# EAGLE design mcp23s17 (EAGLE 6.4)
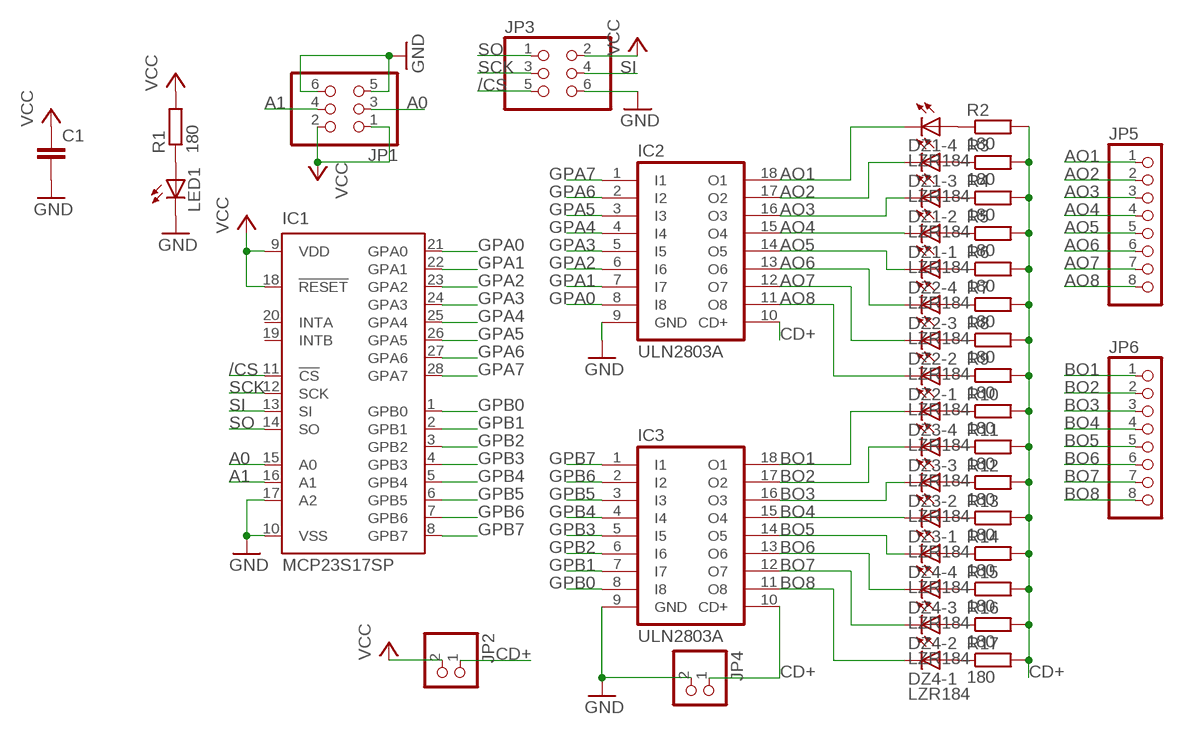
[diagram p0: schematic, sheet 1]

## Parts
C1  C-EU050-024X044  [C050-024X044]
DZ1  LZR184  [LZR184]
DZ2  LZR184  [LZR184]
DZ3  LZR184  [LZR184]
DZ4  LZR184  [LZR184]
IC1  MCP23S17SP  [DIL28-3]
IC2  ULN2803A  [DIL18]
IC3  ULN2803A  [DIL18]
JP1  PINHD-2X3  [2X03]
JP2  PINHD-1X2  [1X02]
JP3  PINHD-2X3  [2X03]
JP4  PINHD-1X2  [1X02]
JP5  PINHD-1X8  [1X08]
JP6  PINHD-1X8  [1X08]
LED1  LED3MM  [LED3MM]
R1  180  R-EU_0204/2V  [0204V]
R2  180  R-EU_0204/2V  [0204V]
R3  180  R-EU_0204/2V  [0204V]
R4  180  R-EU_0204/2V  [0204V]
R5  180  R-EU_0204/2V  [0204V]
R6  180  R-EU_0204/2V  [0204V]
R7  180  R-EU_0204/2V  [0204V]
R8  180  R-EU_0204/2V  [0204V]
R9  180  R-EU_0204/2V  [0204V]
R10  180  R-EU_0204/2V  [0204V]
R11  180  R-EU_0204/2V  [0204V]
R12  180  R-EU_0204/2V  [0204V]
R13  180  R-EU_0204/2V  [0204V]
R14  180  R-EU_0204/2V  [0204V]
R15  180  R-EU_0204/2V  [0204V]
R16  180  R-EU_0204/2V  [0204V]
R17  180  R-EU_0204/2V  [0204V]

## Nets
/CS: IC1.11(!CS) JP3.5
A0: IC1.15(A0) JP1.3
A1: IC1.16(A1) JP1.4
AO1: DZ1.K4(-4:C) IC2.18(O1) JP5.1
AO2: DZ1.K3(-3:C) IC2.17(O2) JP5.2
AO3: DZ1.K2(-2:C) IC2.16(O3) JP5.3
AO4: DZ1.K1(-1:C) IC2.15(O4) JP5.4
AO5: DZ2.K4(-4:C) IC2.14(O5) JP5.5
AO6: DZ2.K3(-3:C) IC2.13(O6) JP5.6
AO7: DZ2.K2(-2:C) IC2.12(O7) JP5.7
AO8: DZ2.K1(-1:C) IC2.11(O8) JP5.8
BO1: DZ3.K4(-4:C) IC3.18(O1) JP6.1
BO2: DZ3.K3(-3:C) IC3.17(O2) JP6.2
BO3: DZ3.K2(-2:C) IC3.16(O3) JP6.3
BO4: DZ3.K1(-1:C) IC3.15(O4) JP6.4
BO5: DZ4.K4(-4:C) IC3.14(O5) JP6.5
BO6: DZ4.K3(-3:C) IC3.13(O6) JP6.6
BO7: DZ4.K2(-2:C) IC3.12(O7) JP6.7
BO8: DZ4.K1(-1:C) IC3.11(O8) JP6.8
CD+: IC2.10(CD+) IC3.10(CD+) JP2.1 JP4.1 R2.2 R3.2 R4.2 R5.2 R6.2 R7.2 R8.2 R9.2 R10.2 R11.2 R12.2 R13.2 R14.2 R15.2 R16.2 R17.2
GND: C1.2 IC1.10(VSS) IC1.17(A2) IC2.9(GND) IC3.9(GND) JP1.5 JP1.6 JP3.6 JP4.2 LED1.K(C)
GPA0: IC1.21(GPA0) IC2.8(I8)
GPA1: IC1.22(GPA1) IC2.7(I7)
GPA2: IC1.23(GPA2) IC2.6(I6)
GPA3: IC1.24(GPA3) IC2.5(I5)
GPA4: IC1.25(GPA4) IC2.4(I4)
GPA5: IC1.26(GPA5) IC2.3(I3)
GPA6: IC1.27(GPA6) IC2.2(I2)
GPA7: IC1.28(GPA7) IC2.1(I1)
GPB0: IC1.1(GPB0) IC3.8(I8)
GPB1: IC1.2(GPB1) IC3.7(I7)
GPB2: IC1.3(GPB2) IC3.6(I6)
GPB3: IC1.4(GPB3) IC3.5(I5)
GPB4: IC1.5(GPB4) IC3.4(I4)
GPB5: IC1.6(GPB5) IC3.3(I3)
GPB6: IC1.7(GPB6) IC3.2(I2)
GPB7: IC1.8(GPB7) IC3.1(I1)
N$2: LED1.A R1.1
N$3: DZ3.A4(-4:A) R10.1
N$4: DZ3.A3(-3:A) R11.1
N$5: DZ3.A2(-2:A) R12.1
N$6: DZ3.A1(-1:A) R13.1
N$7: DZ4.A4(-4:A) R14.1
N$8: DZ4.A3(-3:A) R15.1
N$9: DZ4.A2(-2:A) R16.1
N$13: DZ4.A1(-1:A) R17.1
N$36: DZ1.A4(-4:A) R2.1
N$37: DZ1.A3(-3:A) R3.1
N$38: DZ1.A2(-2:A) R4.1
N$39: DZ1.A1(-1:A) R5.1
N$40: DZ2.A4(-4:A) R6.1
N$41: DZ2.A3(-3:A) R7.1
N$42: DZ2.A2(-2:A) R8.1
N$43: DZ2.A1(-1:A) R9.1
SCK: IC1.12(SCK) JP3.3
SI: IC1.13(SI) JP3.4
SO: IC1.14(SO) JP3.1
VCC: C1.1 IC1.9(VDD) IC1.18(!RESET) JP1.1 JP1.2 JP2.2 JP3.2 R1.2
Unconnected: IC1.19(INTB) IC1.20(INTA)

## Library data of the parts
C1 = rcl:C-EU: CAPACITOR, European symbol
DZ1-DZ4 = led:LZR184: LED BLOCK 4 LEDs, Siemens
IC1 = microchip:MCP23S17: http://ww1.microchip.com/downloads/en/DeviceDoc/21952a.pdf Source: http://ww1.microchip.com/downloads/en/DeviceDoc/21952a.pdf; MF: MICROCHIP; MPN: MCP23S17-E/SP; OC_FARNELL: 1292238; OC_NEWARK: 31K2951
IC2 IC3 = uln-udn:ULN2803A: DRIVER ARRAY
JP1 JP3 = pinhead:PINHD-2X3: PIN HEADER
JP2 JP4 = pinhead:PINHD-1X2: PIN HEADER
JP5 JP6 = pinhead:PINHD-1X8: PIN HEADER
LED1 = led:LED: LED OSRAM: - CHIPLED LG R971, LG N971, LY N971, LG Q971, LY Q971, LO R971, LY R971 LH N974, LH R974 LS Q976, LO Q976, LY Q976 LO Q996 - Hyper CHIPLED LW Q18S LB Q993, LB Q99A, LB R99A - SideLED LS A670, LO A670, LY A670, LG A670, LP A670 LB A673, LV A673, LT A673, LW A673 LH A674 LY A675 LS A676, LA A676, LO A676, LY A676, LW A676 LS A679, LY A679, LG A679 - Hyper Micro SIDELED® LS Y876, LA Y876, LO Y876, LY Y876 LT Y87S - SmartLED LW L88C, LW L88S LB L89C, LB L89S, LG L890 LS L89K, LO L89K, LY L89K LS L896, LA L896, LO L896, LY L896 - TOPLED LS T670, LO T670, LY T670, LG T670, LP T670 LSG T670, LSP T670, LSY T670, LOP T670, LYG T670 LG T671, LOG T671, LSG T671 LB T673, LV T673, LT T673, LW T673 LH T674 LS T676, LA T676, LO T676, LY T676, LB T676, LH T676, LSB T676, LW T676 LB T67C, LV T67C, LT T67C, LS T67K, LO T67K, LY T67K, LW E67C LS E67B, LA E67B, LO E67B, LY E67B, LB E67C, LV E67C, LT E67C LW T67C LS T679, LY T679, LG T679 LS T770, LO T770, LY T770, LG T770, LP T770 LB T773, LV T773, LT T773, LW T773 LH T774 LS E675, LA E675, LY E675, LS T675 LS T776, LA T776, LO T776, LY T776, LB T776 LHGB T686 LT T68C, LB T68C - Hyper Mini TOPLED® LB M676 - Mini TOPLED Santana® LG M470 LS M47K, LO M47K, LY M47K Source: http://www.osram.convergy.de LUXEON: - LUMILED® LXK2-PW12-R00, LXK2-PW12-S00, LXK2-PW14-U00, LXK2-PW14-V00 LXK2-PM12-R00, LXK2-PM12-S00, LXK2-PM14-U00 LXK2-PE12-Q00, LXK2-PE12-R00, LXK2-PE12-S00, LXK2-PE14-T00, LXK2-PE14-U00 LXK2-PB12-K00, LXK2-PB12-L00, LXK2-PB12-M00, LXK2-PB14-N00, LXK2-PB14-P00, LXK2-PB14-Q00 LXK2-PR12-L00, LXK2-PR12-M00, LXK2-PR14-Q00, LXK2-PR14-R00 LXK2-PD12-Q00, LXK2-PD12-R00, LXK2-PD12-S00 LXK2-PH12-R00, LXK2-PH12-S00 LXK2-PL12-P00, LXK2-PL12-Q00, LXK2-PL12-R00 Source: www.luxeon.com KINGBRIGHT: KA-3528ASYC Source: www.kingbright.com
R1-R17 = resistor:R-EU_: RESISTOR, European symbol

## Board
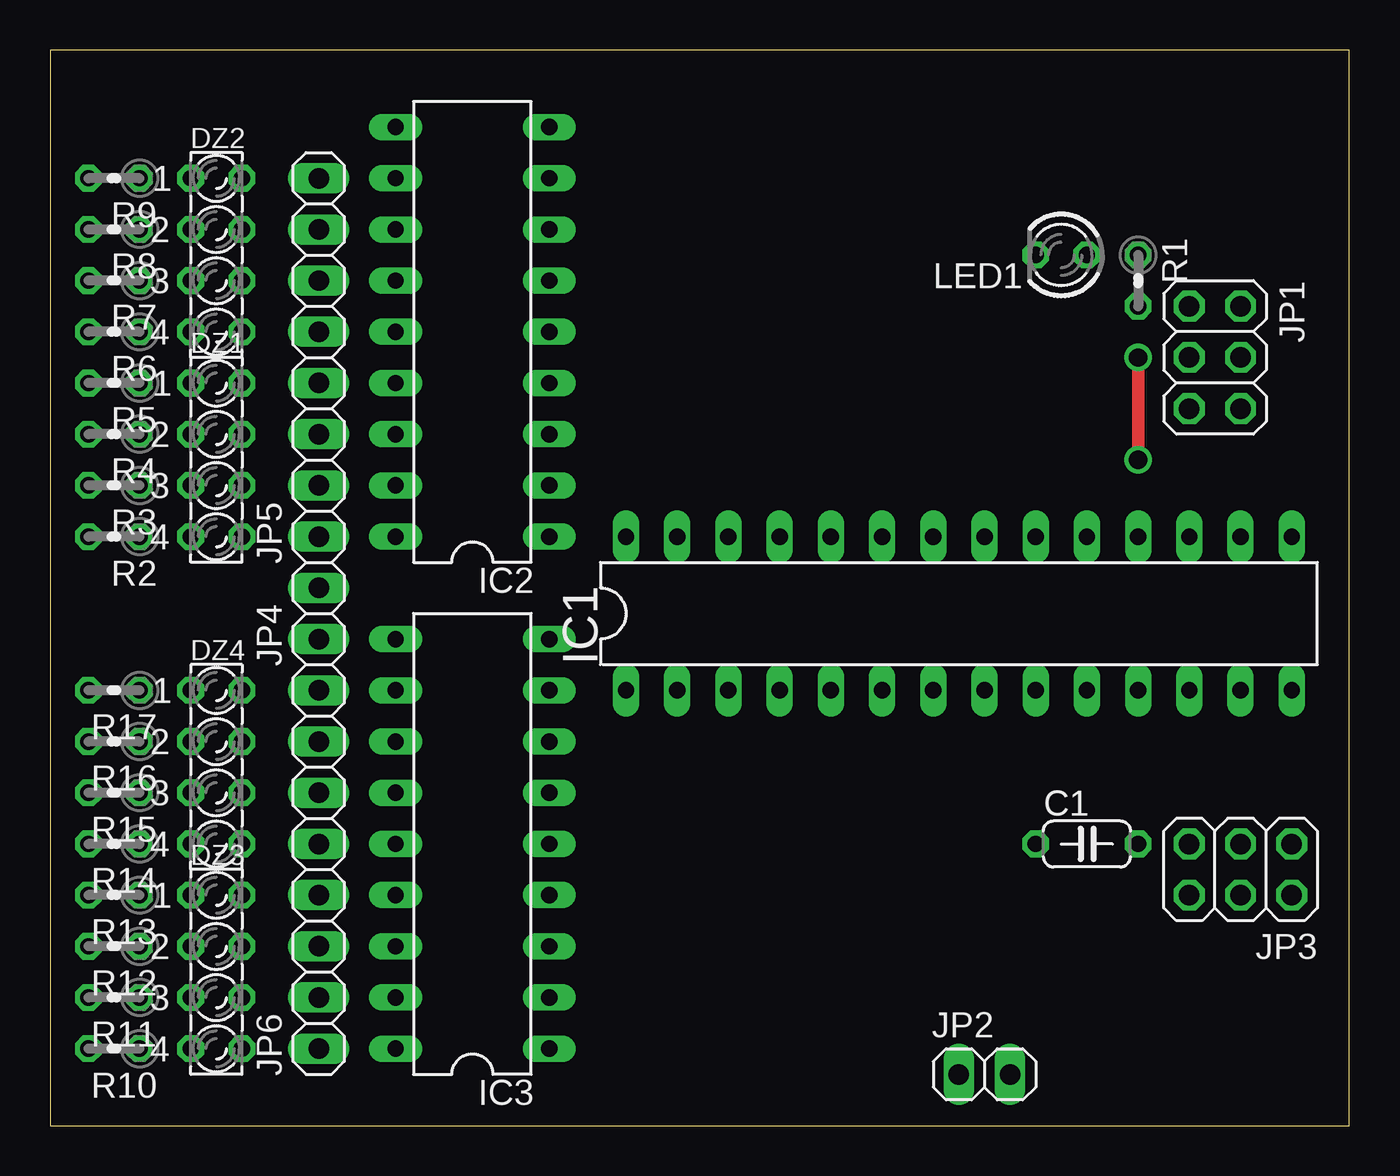
[diagram p1: board, top side]
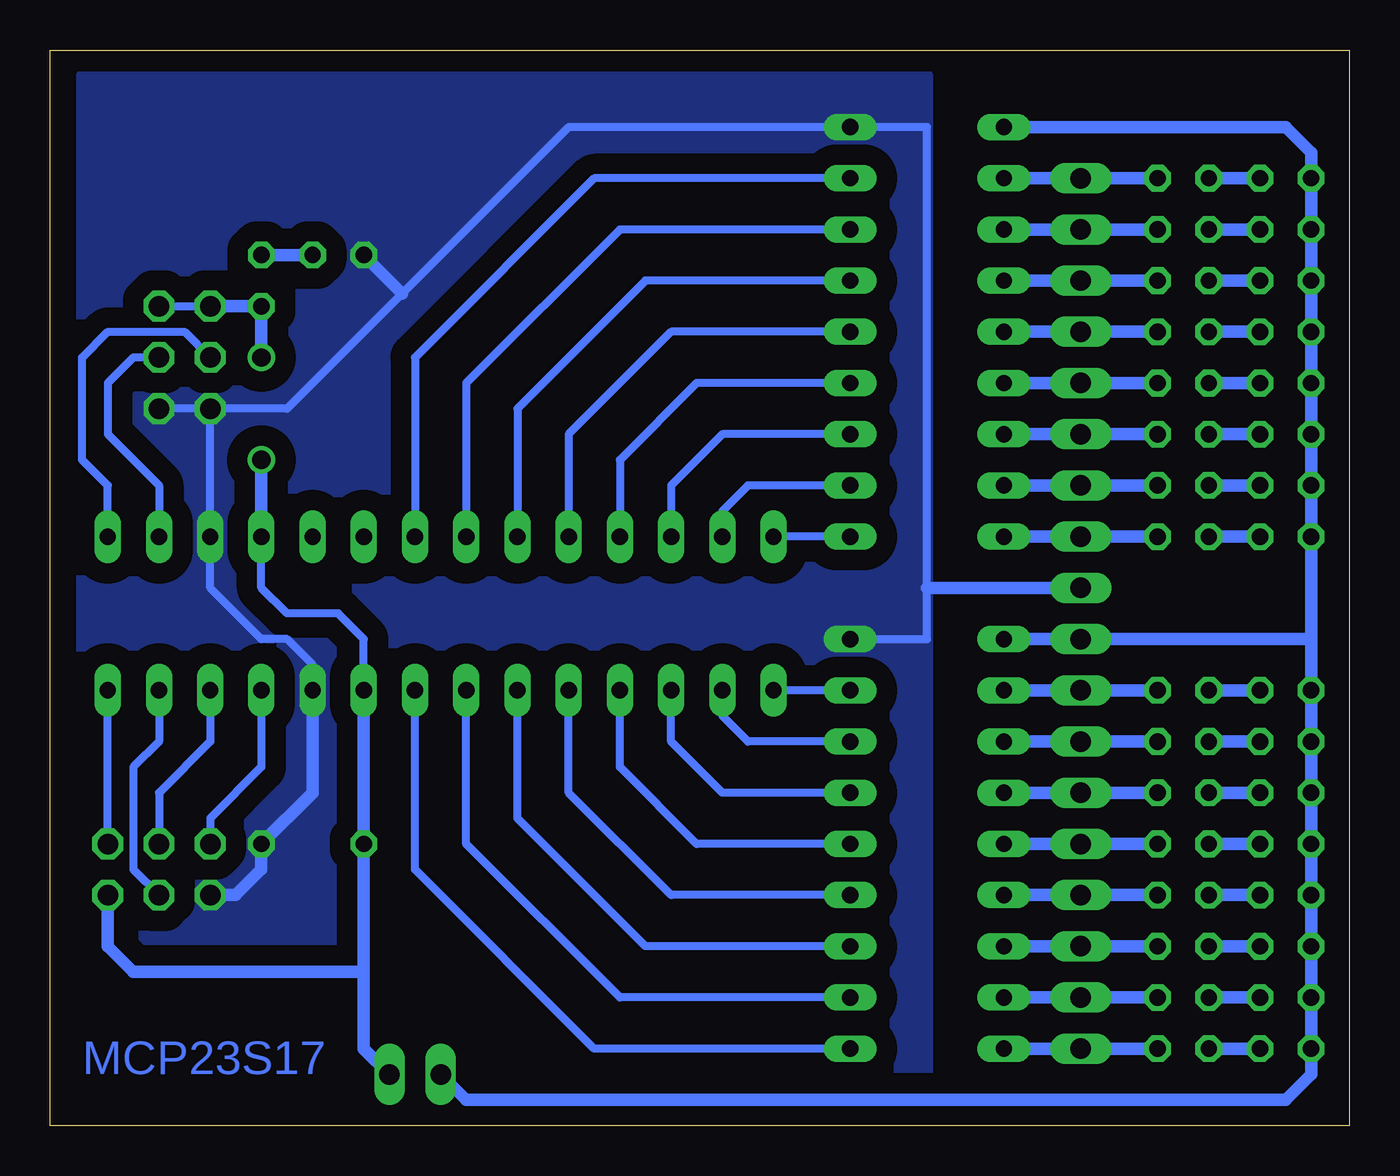
[diagram p2: board, bottom side, seen from below]

Size 64.41 x 53.33 mm. Coordinates in mm from the lower left corner, seen from the top.
Outline: 0,0 64.41,0 64.41,53.33 0,53.33 0,0
Copper layers (1*16): Top 0.035mm / dielectric 1.5mm / Bottom 0.035mm
Design rules "default": minimum track width 10mil, minimum drill 24mil, track to track 8mil, track to pad 8mil, pad to pad 8mil, via to via 8mil, smd to smd 8mil, copper to edge 40mil, drill to drill 8mil, minimum pad ring 10mil, minimum via ring 8mil, stop-mask expansion 4mil, vias tented up to drill 0mil, thermal gap 10mil

### Footprints (pad centres in the part's own frame; a part is rotated, then mirrored left to right if it is on the bottom)
C050-024X044 = drill 0.813 octagon: 1 -2.54,0; 2 2.54,0
LZR184 = drill 0.813 octagon: A1 -1.27,3.81; A2 -1.27,1.27; A3 -1.27,-1.27; A4 -1.27,-3.81; K1 1.27,3.81; K2 1.27,1.27; K3 1.27,-1.27; K4 1.27,-3.81
DIL28-3 = drill 0.813 long: 1 -16.51,-3.81; 2 -13.97,-3.81; 3 -11.43,-3.81; 4 -8.89,-3.81; 5 -6.35,-3.81; 6 -3.81,-3.81; 7 -1.27,-3.81; 8 1.27,-3.81; 9 3.81,-3.81; 10 6.35,-3.81; 11 8.89,-3.81; 12 11.43,-3.81; 13 13.97,-3.81; 14 16.51,-3.81; 15 16.51,3.81; 16 13.97,3.81; 17 11.43,3.81; 18 8.89,3.81; 19 6.35,3.81; 20 3.81,3.81; 21 1.27,3.81; 22 -1.27,3.81; 23 -3.81,3.81; 24 -6.35,3.81; 25 -8.89,3.81; 26 -11.43,3.81; 27 -13.97,3.81; 28 -16.51,3.81
DIL18 = drill 0.813 long: 1 -10.16,-3.81; 2 -7.62,-3.81; 3 -5.08,-3.81; 4 -2.54,-3.81; 5 0,-3.81; 6 2.54,-3.81; 7 5.08,-3.81; 8 7.62,-3.81; 9 10.16,-3.81; 10 10.16,3.81; 11 7.62,3.81; 12 5.08,3.81; 13 2.54,3.81; 14 0,3.81; 15 -2.54,3.81; 16 -5.08,3.81; 17 -7.62,3.81; 18 -10.16,3.81
2X03 = drill 1.016 octagon: 1 -2.54,-1.27; 2 -2.54,1.27; 3 0,-1.27; 4 0,1.27; 5 2.54,-1.27; 6 2.54,1.27
1X02 = drill 1.016 long: 1 -1.27,0; 2 1.27,0
1X08 = drill 1.016 long: 1 -8.89,0; 2 -6.35,0; 3 -3.81,0; 4 -1.27,0; 5 1.27,0; 6 3.81,0; 7 6.35,0; 8 8.89,0
LED3MM = drill 0.813 octagon: A -1.27,0; K 1.27,0
0204V = drill 0.813 octagon: 1 -1.27,0; 2 1.27,0

### Placement (x,y rotation side)
C1  51.41,13.97 0 top
DZ1  8.23,33.02 0 top
DZ2  8.23,43.18 0 top
DZ3  8.23,7.62 0 top
DZ4  8.23,17.78 0 top
IC1  45.06,25.4 0 top
IC2  20.93,39.37 90 top
IC3  20.93,13.97 90 top
JP1  57.76,38.1 270 top
JP2  46.33,2.54 0 top
JP3  59.03,12.7 180 top
JP4  13.31,25.4 90 top
JP5  13.31,38.1 90 top
JP6  13.31,12.7 90 top
LED1  50.14,43.18 180 top
R1  53.95,41.91 270 top
R2  3.15,29.21 180 top
R3  3.15,31.75 180 top
R4  3.15,34.29 180 top
R5  3.15,36.83 180 top
R6  3.15,39.37 180 top
R7  3.15,41.91 180 top
R8  3.15,44.45 180 top
R9  3.15,46.99 180 top
R10  3.15,3.81 180 top
R11  3.15,6.35 180 top
R12  3.15,8.89 180 top
R13  3.15,11.43 180 top
R14  3.15,13.97 180 top
R15  3.15,16.51 180 top
R16  3.15,19.05 180 top
R17  3.15,21.59 180 top

### Tracks (layer width: path | path; a pad name or v marks a point on that pad's centre or on a via)
/CS
  Bottom 0.406: IC1.11 53.95,17.78 56.49,15.24 JP3.5
A0
  Bottom 0.406: IC1.15 61.57,31.75 62.84,33.02 62.84,38.1 61.57,39.37 57.76,39.37 JP1.3
A1
  Bottom 0.406: JP1.4 60.3,38.1 61.57,36.83 61.57,34.29 59.03,31.75 IC1.16
AO1
  Bottom 0.61: IC2.18 JP5.1 DZ1.K4
AO2
  Bottom 0.61: IC2.17 JP5.2 DZ1.K3
AO3
  Bottom 0.61: IC2.16 JP5.3 DZ1.K2
AO4
  Bottom 0.61: IC2.15 JP5.4 DZ1.K1
AO5
  Bottom 0.61: IC2.14 JP5.5 DZ2.K4
AO6
  Bottom 0.61: IC2.13 JP5.6 DZ2.K3
AO7
  Bottom 0.61: IC2.12 JP5.7 DZ2.K2
AO8
  Bottom 0.61: IC2.11 JP5.8 DZ2.K1
BO1
  Bottom 0.61: IC3.18 JP6.1 DZ3.K4
BO2
  Bottom 0.61: IC3.17 JP6.2 DZ3.K3
BO3
  Bottom 0.61: IC3.16 JP6.3 DZ3.K2
BO4
  Bottom 0.61: IC3.15 JP6.4 DZ3.K1
BO5
  Bottom 0.61: IC3.14 JP6.5 DZ4.K4
BO6
  Bottom 0.61: IC3.13 JP6.6 DZ4.K3
BO7
  Bottom 0.61: IC3.12 JP6.7 DZ4.K2
BO8
  Bottom 0.61: IC3.11 JP6.8 DZ4.K1
CD+
  Bottom 0.61: IC3.10 JP4.1 1.88,24.13 | 1.88,24.13 R2.2 R3.2 R4.2 R5.2 R6.2 R7.2 R8.2 R9.2 1.88,48.26 3.15,49.53 IC2.10 | 1.88,24.13 R17.2 R16.2 R15.2 R14.2 R13.2 R12.2 R11.2 R10.2 1.88,2.54 3.15,1.27 43.79,1.27 JP2.1
GND
  Bottom 0.406: JP1.5 JP1.6 | JP1.5 IC1.17 56.49,26.67 53.95,24.13 52.68,24.13 51.41,22.86 IC1.10 | IC3.9 20.93,24.13 20.93,26.67 20.93,49.53 IC2.9 38.71,49.53 46.96,41.27 52.68,35.56 JP1.5
  Bottom 0.61: JP4.2 20.93,26.67 | IC1.10 51.41,16.51 C1.2 53.95,12.7 55.22,11.43 JP3.6 | LED1.K 46.96,41.27
  pour Bottom (isolate 1.016, no thermals): 20.93,1.27 20.93,52.07 62.84,52.07 62.84,1.27
GPA0
  Bottom 0.406: IC2.8 37.44,46.99 46.33,38.1 IC1.21
GPA1
  Bottom 0.406: IC2.7 36.17,44.45 43.79,36.83 IC1.22
GPA2
  Bottom 0.406: IC2.6 34.9,41.91 41.25,35.56 IC1.23
GPA3
  Bottom 0.406: IC2.5 33.63,39.37 38.71,34.29 IC1.24
GPA4
  Bottom 0.406: IC2.4 32.36,36.83 36.17,33.02 IC1.25
GPA5
  Bottom 0.406: IC2.3 31.09,34.29 33.63,31.75 IC1.26
GPA6
  Bottom 0.406: IC2.2 29.82,31.75 31.09,30.48 IC1.27
GPA7
  Bottom 0.406: IC2.1 IC1.28
GPB0
  Bottom 0.406: IC3.8 IC1.1
GPB1
  Bottom 0.406: IC3.7 29.82,19.05 31.09,20.32 IC1.2
GPB2
  Bottom 0.406: IC3.6 31.09,16.51 33.63,19.05 IC1.3
GPB3
  Bottom 0.406: IC3.5 32.36,13.97 36.17,17.78 IC1.4
GPB4
  Bottom 0.406: IC3.4 33.63,11.43 38.71,16.51 IC1.5
GPB5
  Bottom 0.406: IC3.3 34.9,8.89 41.25,15.24 IC1.6
GPB6
  Bottom 0.406: IC3.2 36.17,6.35 43.79,13.97 IC1.7
GPB7
  Bottom 0.406: IC3.1 37.44,3.81 46.33,12.7 IC1.8
N$2
  Bottom 0.61: R1.1 LED1.A
N$3
  Bottom 0.61: R10.1 DZ3.A4
N$4
  Bottom 0.61: R11.1 DZ3.A3
N$5
  Bottom 0.61: R12.1 DZ3.A2
N$6
  Bottom 0.61: R13.1 DZ3.A1
N$7
  Bottom 0.61: R14.1 DZ4.A4
N$8
  Bottom 0.61: R15.1 DZ4.A3
N$9
  Bottom 0.61: R16.1 DZ4.A2
N$13
  Bottom 0.61: DZ4.A1 R17.1
N$36
  Bottom 0.61: DZ1.A4 R2.1
N$37
  Bottom 0.61: R3.1 DZ1.A3
N$38
  Bottom 0.61: DZ1.A2 R4.1
N$39
  Bottom 0.61: R5.1 DZ1.A1
N$40
  Bottom 0.61: DZ2.A4 R6.1
N$41
  Bottom 0.61: R7.1 DZ2.A3
N$42
  Bottom 0.61: DZ2.A2 R8.1
N$43
  Bottom 0.61: R9.1 DZ2.A1
SCK
  Bottom 0.406: IC1.12 56.49,19.05 59.03,16.51 JP3.3
SI
  Bottom 0.406: IC1.13 59.03,19.05 60.3,17.78 60.3,12.7 JP3.4
SO
  Bottom 0.406: JP3.1 IC1.14
VCC  (via drill 0.9)
  Top 0.61: v53.95,33.02 v53.95,38.1
  Bottom 0.406: JP1.2 JP1.1 | IC1.9 48.87,24.13 50.14,25.4 52.68,25.4 53.95,26.67 IC1.18
  Bottom 0.61: IC1.18 v53.95,33.02 | JP1.1 R1.2 v53.95,38.1 | IC1.9 C1.1 48.87,7.62 | JP3.2 61.57,8.89 60.3,7.62 48.87,7.62 | 48.87,7.62 48.87,3.81 JP2.2

### Text on the board
Bottom: MCP23S17